# Altium schematic sheet Remote Feedback.SchDoc
size A3
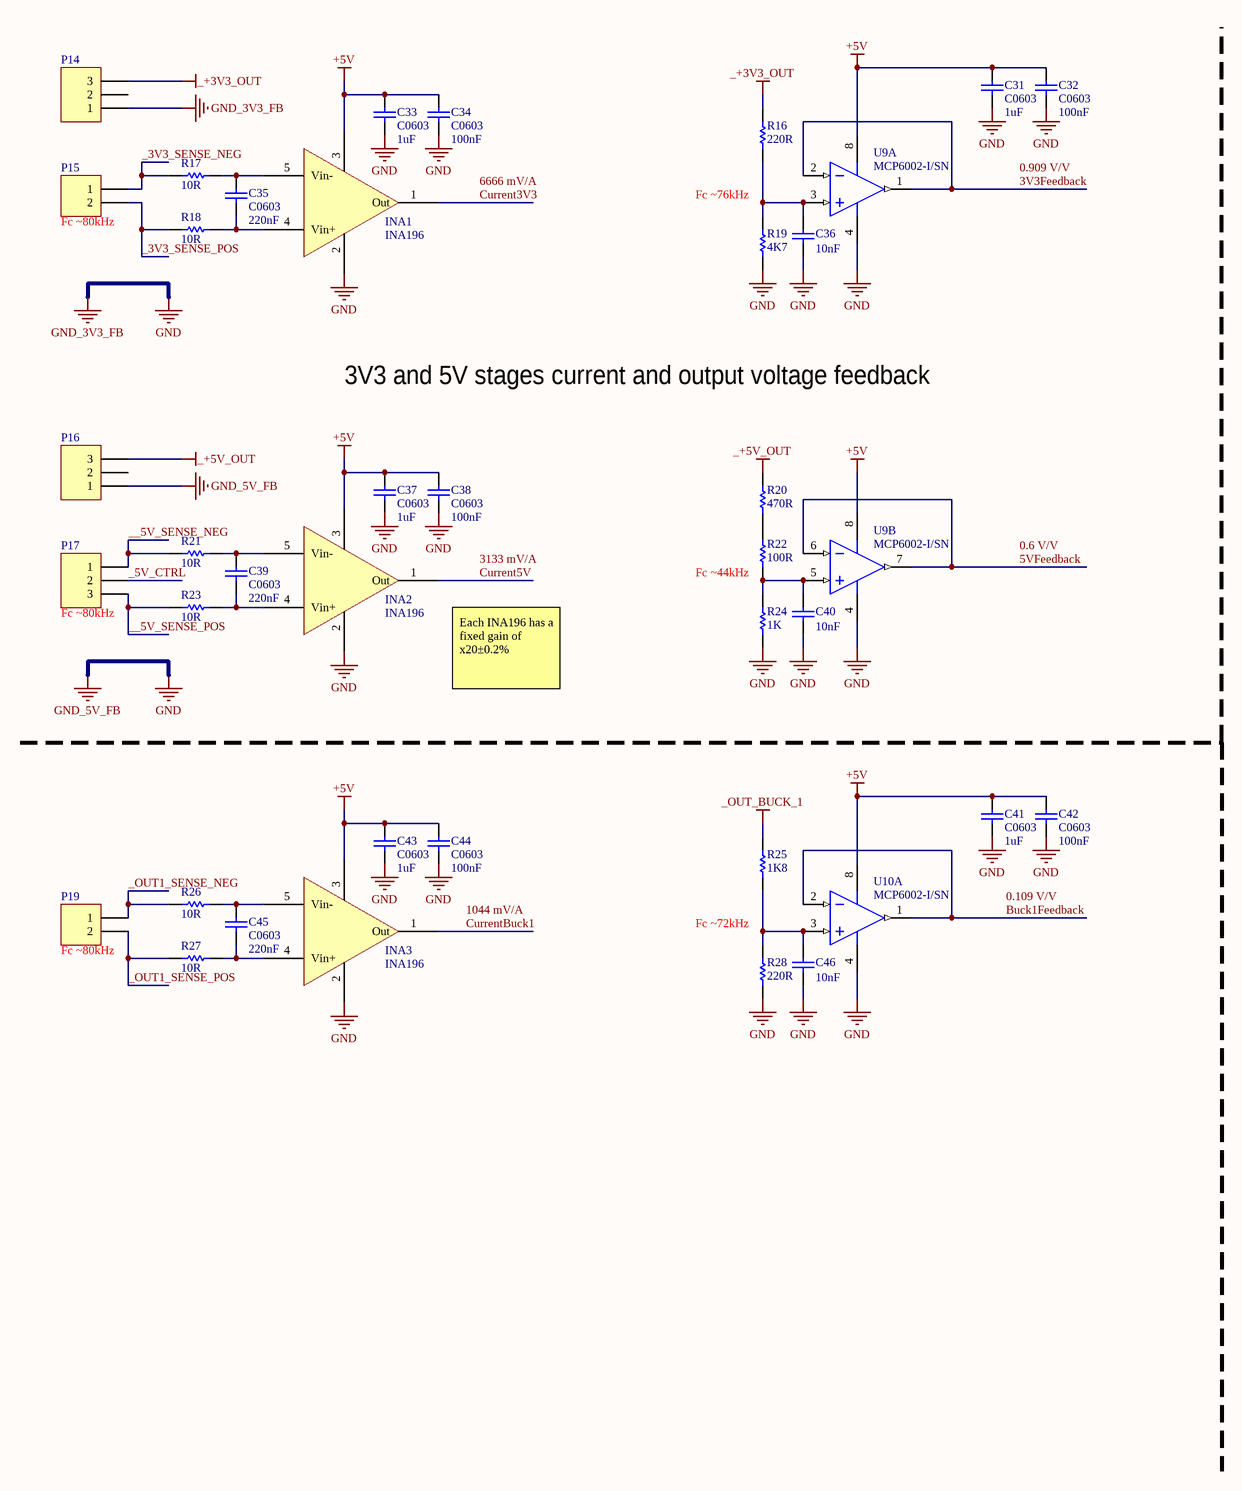
[diagram p0: Remote Feedback.SchDoc]

## Parts
C31  C0603  value 1uF  [0603]
C32  C0603  value 100nF  [0603]
C33  C0603  value 1uF  [0603]
C34  C0603  value 100nF  [0603]
C35  C0603  value 220nF  [0603]
C36  value 10nF  [C0805]  (hidden comment: CDR01)
C37  C0603  value 1uF  [0603]
C38  C0603  value 100nF  [0603]
C39  C0603  value 220nF  [0603]
C40  value 10nF  [C0805]  (hidden comment: CDR01)
C41  C0603  value 1uF  [0603]
C42  C0603  value 100nF  [0603]
C43  C0603  value 1uF  [0603]
C44  C0603  value 100nF  [0603]
C45  C0603  value 220nF  [0603]
C46  value 10nF  [C0805]  (hidden comment: CDR01)
INA1  INA196  [SOT-23-5]
INA2  INA196  [SOT-23-5]
INA3  INA196  [SOT-23-5]
P14  Header 3  [My_1X03]  (value not drawn)
P15  Header 2  [My_1X02]  (value not drawn)
P16  Header 3  [My_1X03]  (value not drawn)
P17  Header 3  [My_1X03]  (value not drawn)
P19  Header 2  [My_1X02]  (value not drawn)
R16  value 220R  [8RB-1206]  (hidden comment: SMD)
R17  10R  [ERA-0603]
R18  10R  [ERA-0603]
R19  value 4K7  [8RB-1206]  (hidden comment: SMD)
R20  value 470R  [8RB-1206]  (hidden comment: SMD)
R21  10R  [ERA-0603]
R22  value 100R  [8RB-1206]  (hidden comment: SMD)
R23  10R  [ERA-0603]
R24  value 1K  [8RB-1206]  (hidden comment: SMD)
R25  value 1K8  [8RB-1206]  (hidden comment: SMD)
R26  10R  [ERA-0603]
R27  10R  [ERA-0603]
R28  value 220R  [8RB-1206]  (hidden comment: SMD)
U9  MCP6002-I/SN  [SOIC-SN8_N]  (parts A,B of 2)
U10  MCP6002-I/SN  [SOIC-SN8_N]  (part A of 2)

## Nets
+5V: C31.2 C32.2 C33.2 C34.2 C37.2 C38.2 C41.2 C42.2 C43.2 C44.2 INA1.3 INA2.3 INA3.3 U9.8(VDD) U10.8(VDD)
_+3V3_OUT: P14.3 R16.2
_+5V_OUT: P16.3 R20.2
_OUT_BUCK_1: R25.2
GND: C31.1 C32.1 C33.1 C34.1 C36.1 C37.1 C38.1 C40.1 C41.1 C42.1 C43.1 C44.1 C46.1 INA1.2(GND) INA2.2(GND) INA3.2(GND) P14.1 P16.1 R19.1 R24.1 R28.1 U9.4(VSS) U10.4(VSS)  [also labelled GND_3V3_FB, GND_5V_FB]
3V3Feedback: U9.1(VOUTA) U9.2(VINA-)
5VFeedback: U9.6(VINB-) U9.7(VOUTB)
_3V3_SENSE_NEG: P15.1 R17.2
_3V3_SENSE_POS: P15.2 R18.2
_5V_CTRL: P17.2
__5V_SENSE_NEG: P17.1 R21.2
__5V_SENSE_POS: P17.3 R23.2
_OUT1_SENSE_NEG: P19.1 R26.2
_OUT1_SENSE_POS: P19.2 R27.2
Buck1Feedback: U10.1(VOUTA) U10.2(VINA-)
Current3V3: INA1.1(Out)
Current5V: INA2.1(Out)
CurrentBuck1: INA3.1(Out)
NetC35_1: C35.1 INA1.4(Vin+) R18.1
NetC35_2: C35.2 INA1.5(Vin-) R17.1
NetC36_2: C36.2 R16.1 R19.2 U9.3(VINA+)
NetC39_1: C39.1 INA2.4(Vin+) R23.1
NetC39_2: C39.2 INA2.5(Vin-) R21.1
NetC40_2: C40.2 R22.1 R24.2 U9.5(VINB+)
NetC45_1: C45.1 INA3.4(Vin+) R27.1
NetC45_2: C45.2 INA3.5(Vin-) R26.1
NetC46_2: C46.2 R25.1 R28.2 U10.3(VINA+)
NetR20_1: R20.1 R22.2

Not connected (* = marked no-connect by the designer): P14 2; P16 2

## Notes on the sheet
- (near P15) Fc ~80kHz
- Fc ~76kHz
- 3V3 and 5V stages current and output voltage feedback
- (near R22) Fc ~44kHz
- (near P17) Fc ~80kHz
- Each INA196 has a fixed gain of x20±0.2%
- (near P19) Fc ~80kHz
- Fc ~72kHz
- Labels drawn without touching a wire or pin: 0.6 V/V, 0.109 V/V, 0.909 V/V, 1044 mV/A, 3133 mV/A, 6666 mV/A

## Library data of the parts
C31-C35 C37-C39 C41-C45 = C0603: C1608X7R1C105K X7R; Note: Footprint corresponds to dimensions for bulk cassette packaging. This case size has tightened tolerances.; Published: 17-Jul-2002; LatestRevisionDate: 19-Mar-2004; LatestRevisionNote: Silkscreen size reduced.; DatasheetDocument: Mar-2001; PackageDocument: Mar-2001; PackageReference: 0603; Publisher: Altium Limited; Code_JEITA: 0603; Code_IPC: 1608 [0603]; ComponentLink1Description: Manufacturer Link; ComponentLink1URL: http://www.kemet.com/; ComponentLink2Description: Datasheet; ComponentLink2URL: http://www.kemet.com/kemet/web/homepage/kechome.nsf/vapubfilesname/F3102TA.pdf/$file/F3102TA.pdf
C36 C40 C46 = CDR01: Ceramic Chip Capacitor - MIL-PRF-55681; Published: 17-Jul-2002; LatestRevisionDate: 19-Mar-2004; LatestRevisionNote: Silkscreen size reduced.; DatasheetDocument: Mar-2001; PackageDocument: Mar-2001; PackageReference: C0805; Publisher: Altium Limited; Code_JEITA: 0805; Code_IPC: 2012[0805]; ComponentLink1Description: Manufacturer Link; ComponentLink1URL: http://www.kemet.com/; ComponentLink2Description: Datasheet; ComponentLink2URL: http://www.kemet.com/kemet/web/homepage/kechome.nsf/vapubfilesname/F3102TA.pdf/$file/F3102TA.pdf
INA1-INA3 = INA196: Current Shunt Monitor −16 V to +80 V Common-Mode Range
P14 P16 P17 = Header 3: Header, 3-Pin; LatestRevisionDate: 17-Jul-2002; LatestRevisionNote: Re-released for DXP Platform.; Publisher: Altium Limited
P15 P19 = Header 2: Header, 2-Pin; LatestRevisionDate: 17-Jul-2002; LatestRevisionNote: Re-released for DXP Platform.; Publisher: Altium Limited
R16 R19 R20 R22 R24 R25 R28 = ERJ8BQ: Low Ohmic Value Thick Film Chip Resistor, 0.22 Ohm to 9.1 Ohm Range, 1%, 2% and 5% Tolerance, 1206 Size, 0.33 W; Published: 17-Dec-2003; LatestRevisionDate: 19-Mar-2004; LatestRevisionNote: Silkscreen size reduced.; PackageDocument: Mar-2003; PackageReference: 8RB-1206; Publisher: Altium Limited; Code_IPC: 3216 [1206]; ComponentLink1Description: Manufacturer Link; ComponentLink1URL: http://www.panasonic.com/industrial/components/resistive_products.htm; ComponentLink2Description: Datasheet; ComponentLink2URL: http://www.panasonic.com/industrial/components/pdf/AOA0000CE3.pdf
R17 R18 R21 R23 R26 R27 = ERA3Y: Rectangular Thick Film Chip Resistor, 10 Ohm to 330k Ohm Range, 0.1% and 0.5% Tolerance, 0603 Size, 0.063 W; Note: If flow soldering, adjust pad width of PCB Footprint to 0.7 - 0.8 times the width of the resistor.; Published: 17-Dec-2003; LatestRevisionDate: 19-Mar-2004; LatestRevisionNote: Silkscreen size reduced.; PackageDocument: Mar-2003; PackageReference: ERA-0603; Publisher: Altium Limited; Code_IPC: 1608 [0603]; ComponentLink1Description: Manufacturer Link; ComponentLink1URL: http://www.panasonic.com/industrial/components/resistive_products.htm; ComponentLink2Description: Datasheet; ComponentLink2URL: http://www.panasonic.com/industrial/components/pdf/AOA0000CE8.pdf
U9 U10 = MCP6002-I/SN: 1 MHz, Low-Power Operational Amplifier, 8-Pin SOIC, Industrial Temperature; Manufacturer: Microchip; DatasheetVersion: revJ, Nov-2009; PackageVersion: revBB, Aug-2009; PackageReference: SOIC-SN8; PackageDescription: 8-Lead Plastic Small Outline (SN) - Narrow, 3.90mm Body [SOIC]; Supplier 1: Digi-Key; Supplier Part Number 1: MCP6002-I/SN-ND; Supplier 2: Farnell; Supplier Part Number 2: 1292246; Supplier 3: Newark; Supplier Part Number 3: 63K5672; Supplier 4: Mouser; Supplier Part Number 4: 579-MCP6002-I/SN; Mounting Technology: Surface Mount; Code_JEDEC: MS-012; Code_IPC: SOIC127P600-8; PartNumber: MCP6002-I/SN; ComponentLink1Description: Manufacturer URL; ComponentLink1URL: http://www.microchip.com/; ComponentLink2Description: Datasheet; ComponentLink2URL: http://ww1.microchip.com/downloads/en/DeviceDoc/21733j.pdf; ComponentLink3Description: Package Specification; ComponentLink3URL: http://www.microchip.com/stellent/groups/techpub_sg/documents/packagingspec/en012702.pdf